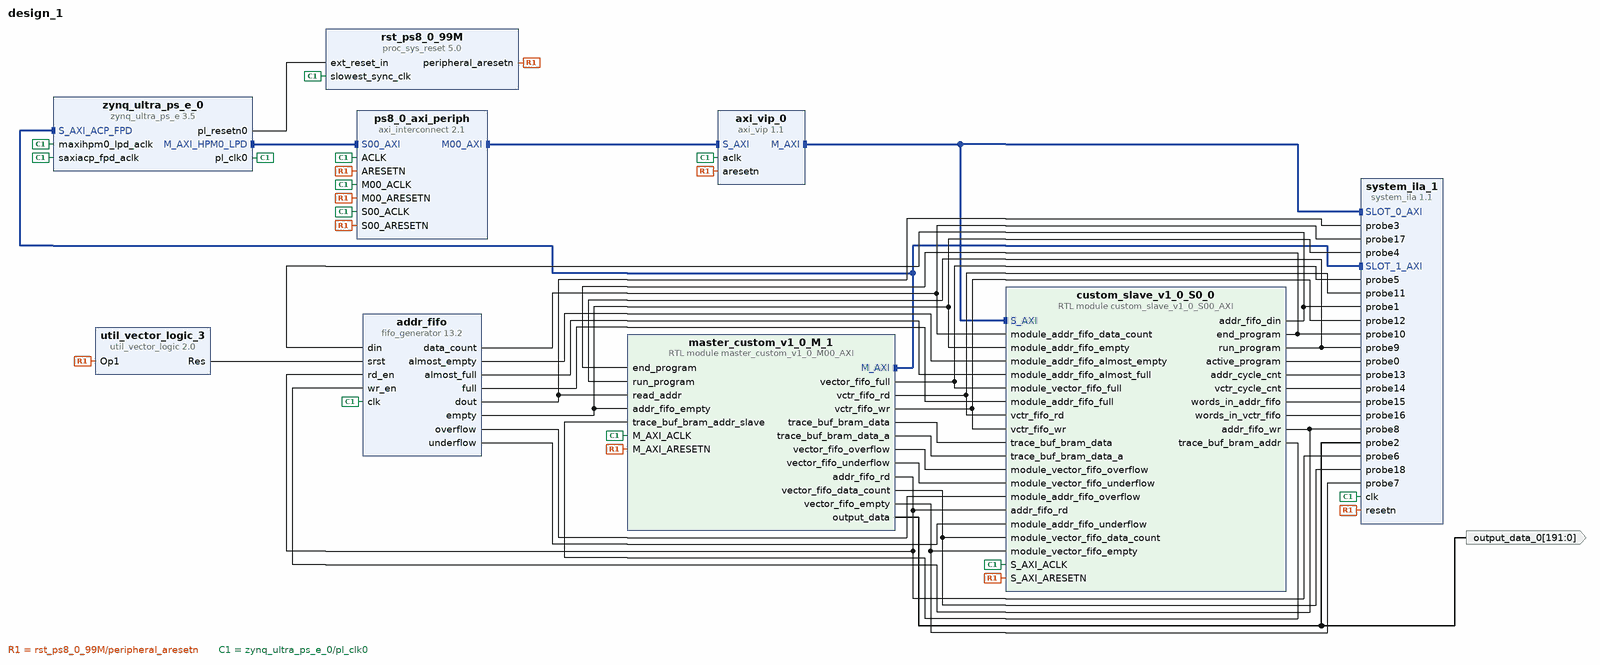
[diagram p0: block diagram of the top level]
# Vivado block design design_1, xczu9eg-ffvb1156-2-e, Vivado 2023.2
create_bd_design design_1

create_bd_port -dir O -from 191 -to 0 output_data_0

create_bd_cell -type ip -vlnv xilinx.com:ip:zynq_ultra_ps_e:3.5 zynq_ultra_ps_e_0
set_property -dict [list \
  CONFIG.CAN0_BOARD_INTERFACE custom \
  CONFIG.CAN1_BOARD_INTERFACE custom \
  CONFIG.CSU_BOARD_INTERFACE custom \
  CONFIG.DP_BOARD_INTERFACE custom \
  CONFIG.GEM0_BOARD_INTERFACE custom \
  CONFIG.GEM1_BOARD_INTERFACE custom \
  CONFIG.GEM2_BOARD_INTERFACE custom \
  CONFIG.GEM3_BOARD_INTERFACE custom \
  CONFIG.GPIO_BOARD_INTERFACE custom \
  CONFIG.IIC0_BOARD_INTERFACE custom \
  CONFIG.IIC1_BOARD_INTERFACE custom \
  CONFIG.NAND_BOARD_INTERFACE custom \
  CONFIG.PCIE_BOARD_INTERFACE custom \
  CONFIG.PJTAG_BOARD_INTERFACE custom \
  CONFIG.PMU_BOARD_INTERFACE custom \
  CONFIG.PSU_BANK_0_IO_STANDARD LVCMOS18 \
  CONFIG.PSU_BANK_1_IO_STANDARD LVCMOS18 \
  CONFIG.PSU_BANK_2_IO_STANDARD LVCMOS18 \
  CONFIG.PSU_BANK_3_IO_STANDARD LVCMOS18 \
  CONFIG.PSU_DYNAMIC_DDR_CONFIG_EN 1 \
  CONFIG.PSU_USB3__DUAL_CLOCK_ENABLE 1 \
  CONFIG.PSU__CAN1__PERIPHERAL__ENABLE 0 \
  CONFIG.PSU__CRF_APB__ACPU_CTRL__FREQMHZ 1200 \
  CONFIG.PSU__CRF_APB__ACPU_CTRL__SRCSEL APLL \
  CONFIG.PSU__CRF_APB__APLL_CTRL__SRCSEL PSS_REF_CLK \
  CONFIG.PSU__CRF_APB__DBG_FPD_CTRL__FREQMHZ 250 \
  CONFIG.PSU__CRF_APB__DBG_FPD_CTRL__SRCSEL IOPLL \
  CONFIG.PSU__CRF_APB__DBG_TRACE_CTRL__FREQMHZ 250 \
  CONFIG.PSU__CRF_APB__DBG_TRACE_CTRL__SRCSEL IOPLL \
  CONFIG.PSU__CRF_APB__DBG_TSTMP_CTRL__FREQMHZ 250 \
  CONFIG.PSU__CRF_APB__DBG_TSTMP_CTRL__SRCSEL IOPLL \
  CONFIG.PSU__CRF_APB__DDR_CTRL__FREQMHZ 800 \
  CONFIG.PSU__CRF_APB__DDR_CTRL__SRCSEL DPLL \
  CONFIG.PSU__CRF_APB__DPDMA_REF_CTRL__FREQMHZ 600 \
  CONFIG.PSU__CRF_APB__DPDMA_REF_CTRL__SRCSEL APLL \
  CONFIG.PSU__CRF_APB__DPLL_CTRL__SRCSEL PSS_REF_CLK \
  CONFIG.PSU__CRF_APB__DP_AUDIO_REF_CTRL__SRCSEL RPLL \
  CONFIG.PSU__CRF_APB__DP_STC_REF_CTRL__SRCSEL RPLL \
  CONFIG.PSU__CRF_APB__DP_VIDEO_REF_CTRL__SRCSEL VPLL \
  CONFIG.PSU__CRF_APB__GDMA_REF_CTRL__FREQMHZ 600 \
  CONFIG.PSU__CRF_APB__GDMA_REF_CTRL__SRCSEL APLL \
  CONFIG.PSU__CRF_APB__GPU_REF_CTRL__FREQMHZ 500 \
  CONFIG.PSU__CRF_APB__GPU_REF_CTRL__SRCSEL IOPLL \
  CONFIG.PSU__CRF_APB__TOPSW_LSBUS_CTRL__FREQMHZ 100 \
  CONFIG.PSU__CRF_APB__TOPSW_LSBUS_CTRL__SRCSEL IOPLL \
  CONFIG.PSU__CRF_APB__TOPSW_MAIN_CTRL__FREQMHZ 533.33 \
  CONFIG.PSU__CRF_APB__TOPSW_MAIN_CTRL__SRCSEL DPLL \
  CONFIG.PSU__CRF_APB__VPLL_CTRL__SRCSEL PSS_REF_CLK \
  CONFIG.PSU__CRL_APB__ADMA_REF_CTRL__FREQMHZ 500 \
  CONFIG.PSU__CRL_APB__ADMA_REF_CTRL__SRCSEL IOPLL \
  CONFIG.PSU__CRL_APB__CAN1_REF_CTRL__FREQMHZ 100 \
  CONFIG.PSU__CRL_APB__CAN1_REF_CTRL__SRCSEL IOPLL \
  CONFIG.PSU__CRL_APB__CPU_R5_CTRL__FREQMHZ 500 \
  CONFIG.PSU__CRL_APB__CPU_R5_CTRL__SRCSEL IOPLL \
  CONFIG.PSU__CRL_APB__DBG_LPD_CTRL__FREQMHZ 250 \
  CONFIG.PSU__CRL_APB__DBG_LPD_CTRL__SRCSEL IOPLL \
  CONFIG.PSU__CRL_APB__GEM3_REF_CTRL__FREQMHZ 125 \
  CONFIG.PSU__CRL_APB__GEM3_REF_CTRL__SRCSEL IOPLL \
  CONFIG.PSU__CRL_APB__I2C0_REF_CTRL__FREQMHZ 100 \
  CONFIG.PSU__CRL_APB__I2C0_REF_CTRL__SRCSEL IOPLL \
  CONFIG.PSU__CRL_APB__I2C1_REF_CTRL__FREQMHZ 100 \
  CONFIG.PSU__CRL_APB__I2C1_REF_CTRL__SRCSEL IOPLL \
  CONFIG.PSU__CRL_APB__IOPLL_CTRL__SRCSEL PSS_REF_CLK \
  CONFIG.PSU__CRL_APB__IOU_SWITCH_CTRL__FREQMHZ 250 \
  CONFIG.PSU__CRL_APB__IOU_SWITCH_CTRL__SRCSEL IOPLL \
  CONFIG.PSU__CRL_APB__LPD_LSBUS_CTRL__FREQMHZ 100 \
  CONFIG.PSU__CRL_APB__LPD_LSBUS_CTRL__SRCSEL IOPLL \
  CONFIG.PSU__CRL_APB__LPD_SWITCH_CTRL__FREQMHZ 500 \
  CONFIG.PSU__CRL_APB__LPD_SWITCH_CTRL__SRCSEL IOPLL \
  CONFIG.PSU__CRL_APB__PCAP_CTRL__FREQMHZ 200 \
  CONFIG.PSU__CRL_APB__PCAP_CTRL__SRCSEL IOPLL \
  CONFIG.PSU__CRL_APB__PL0_REF_CTRL__FREQMHZ 310 \
  CONFIG.PSU__CRL_APB__PL0_REF_CTRL__SRCSEL RPLL \
  CONFIG.PSU__CRL_APB__QSPI_REF_CTRL__FREQMHZ 125 \
  CONFIG.PSU__CRL_APB__QSPI_REF_CTRL__SRCSEL IOPLL \
  CONFIG.PSU__CRL_APB__RPLL_CTRL__SRCSEL PSS_REF_CLK \
  CONFIG.PSU__CRL_APB__SDIO1_REF_CTRL__FREQMHZ 200 \
  CONFIG.PSU__CRL_APB__SDIO1_REF_CTRL__SRCSEL IOPLL \
  CONFIG.PSU__CRL_APB__TIMESTAMP_REF_CTRL__FREQMHZ 100 \
  CONFIG.PSU__CRL_APB__TIMESTAMP_REF_CTRL__SRCSEL IOPLL \
  CONFIG.PSU__CRL_APB__UART0_REF_CTRL__FREQMHZ 100 \
  CONFIG.PSU__CRL_APB__UART0_REF_CTRL__SRCSEL IOPLL \
  CONFIG.PSU__CRL_APB__UART1_REF_CTRL__FREQMHZ 100 \
  CONFIG.PSU__CRL_APB__UART1_REF_CTRL__SRCSEL IOPLL \
  CONFIG.PSU__CRL_APB__USB0_BUS_REF_CTRL__FREQMHZ 250 \
  CONFIG.PSU__CRL_APB__USB0_BUS_REF_CTRL__SRCSEL IOPLL \
  CONFIG.PSU__CRL_APB__USB3_DUAL_REF_CTRL__FREQMHZ 20 \
  CONFIG.PSU__CRL_APB__USB3_DUAL_REF_CTRL__SRCSEL IOPLL \
  CONFIG.PSU__CRL_APB__USB3__ENABLE 1 \
  CONFIG.PSU__CSUPMU__PERIPHERAL__VALID 1 \
  CONFIG.PSU__DDRC__BUS_WIDTH {64 Bit} \
  CONFIG.PSU__DDRC__COMPONENTS UDIMM \
  CONFIG.PSU__DDRC__DEVICE_CAPACITY {4096 MBits} \
  CONFIG.PSU__DDRC__DRAM_WIDTH {8 Bits} \
  CONFIG.PSU__DDRC__ECC Enabled \
  CONFIG.PSU__DDRC__MEMORY_TYPE {DDR 4} \
  CONFIG.PSU__DDRC__SPEED_BIN DDR4_1600J \
  CONFIG.PSU__DDR_HIGH_ADDRESS_GUI_ENABLE 1 \
  CONFIG.PSU__DDR__INTERFACE__FREQMHZ 400.000 \
  CONFIG.PSU__DEVICE_TYPE EG \
  CONFIG.PSU__DISPLAYPORT__PERIPHERAL__ENABLE 0 \
  CONFIG.PSU__DLL__ISUSED 1 \
  CONFIG.PSU__ENET3__FIFO__ENABLE 0 \
  CONFIG.PSU__ENET3__GRP_MDIO__ENABLE 1 \
  CONFIG.PSU__ENET3__GRP_MDIO__IO {MIO 76 .. 77} \
  CONFIG.PSU__ENET3__PERIPHERAL__ENABLE 1 \
  CONFIG.PSU__ENET3__PERIPHERAL__IO {MIO 64 .. 75} \
  CONFIG.PSU__ENET3__PTP__ENABLE 0 \
  CONFIG.PSU__ENET3__TSU__ENABLE 0 \
  CONFIG.PSU__FPGA_PL0_ENABLE 1 \
  CONFIG.PSU__GEM3_COHERENCY 0 \
  CONFIG.PSU__GEM3_ROUTE_THROUGH_FPD 0 \
  CONFIG.PSU__GEM__TSU__ENABLE 0 \
  CONFIG.PSU__GPIO0_MIO__IO {MIO 0 .. 25} \
  CONFIG.PSU__GPIO0_MIO__PERIPHERAL__ENABLE 1 \
  CONFIG.PSU__GPIO1_MIO__IO {MIO 26 .. 51} \
  CONFIG.PSU__GPIO1_MIO__PERIPHERAL__ENABLE 1 \
  CONFIG.PSU__I2C0__PERIPHERAL__ENABLE 1 \
  CONFIG.PSU__I2C0__PERIPHERAL__IO {MIO 14 .. 15} \
  CONFIG.PSU__I2C1__PERIPHERAL__ENABLE 1 \
  CONFIG.PSU__I2C1__PERIPHERAL__IO {MIO 16 .. 17} \
  CONFIG.PSU__IOU_SLCR__IOU_TTC_APB_CLK__TTC0_SEL APB \
  CONFIG.PSU__IOU_SLCR__IOU_TTC_APB_CLK__TTC1_SEL APB \
  CONFIG.PSU__IOU_SLCR__IOU_TTC_APB_CLK__TTC2_SEL APB \
  CONFIG.PSU__IOU_SLCR__IOU_TTC_APB_CLK__TTC3_SEL APB \
  CONFIG.PSU__OVERRIDE_HPX_QOS 0 \
  CONFIG.PSU__OVERRIDE__BASIC_CLOCK 0 \
  CONFIG.PSU__PCIE__CLASS_CODE_BASE 0x06 \
  CONFIG.PSU__PCIE__CLASS_CODE_INTERFACE 0x0 \
  CONFIG.PSU__PCIE__CLASS_CODE_SUB 0x4 \
  CONFIG.PSU__PCIE__DEVICE_ID 0xD021 \
  CONFIG.PSU__PCIE__REVISION_ID 0x0 \
  CONFIG.PSU__PCIE__SUBSYSTEM_ID 0x7 \
  CONFIG.PSU__PCIE__SUBSYSTEM_VENDOR_ID 0x10EE \
  CONFIG.PSU__PCIE__VENDOR_ID 0x10EE \
  CONFIG.PSU__PMU_COHERENCY 0 \
  CONFIG.PSU__PMU__AIBACK__ENABLE 0 \
  CONFIG.PSU__PMU__EMIO_GPI__ENABLE 0 \
  CONFIG.PSU__PMU__EMIO_GPO__ENABLE 0 \
  CONFIG.PSU__PMU__GPI0__ENABLE 0 \
  CONFIG.PSU__PMU__GPI1__ENABLE 0 \
  CONFIG.PSU__PMU__GPI2__ENABLE 0 \
  CONFIG.PSU__PMU__GPI3__ENABLE 0 \
  CONFIG.PSU__PMU__GPI4__ENABLE 0 \
  CONFIG.PSU__PMU__GPI5__ENABLE 0 \
  CONFIG.PSU__PMU__GPO0__ENABLE 0 \
  CONFIG.PSU__PMU__GPO1__ENABLE 0 \
  CONFIG.PSU__PMU__GPO2__ENABLE 1 \
  CONFIG.PSU__PMU__GPO2__IO {MIO 34} \
  CONFIG.PSU__PMU__GPO2__POLARITY high \
  CONFIG.PSU__PMU__GPO3__ENABLE 0 \
  CONFIG.PSU__PMU__GPO4__ENABLE 0 \
  CONFIG.PSU__PMU__GPO5__ENABLE 0 \
  CONFIG.PSU__PMU__PERIPHERAL__ENABLE 1 \
  CONFIG.PSU__PMU__PLERROR__ENABLE 0 \
  CONFIG.PSU__PRESET_APPLIED 1 \
  CONFIG.PSU__PSS_REF_CLK__FREQMHZ 33.330 \
  CONFIG.PSU__QSPI_COHERENCY 0 \
  CONFIG.PSU__QSPI_ROUTE_THROUGH_FPD 0 \
  CONFIG.PSU__QSPI__GRP_FBCLK__ENABLE 1 \
  CONFIG.PSU__QSPI__GRP_FBCLK__IO {MIO 6} \
  CONFIG.PSU__QSPI__PERIPHERAL__DATA_MODE x4 \
  CONFIG.PSU__QSPI__PERIPHERAL__ENABLE 1 \
  CONFIG.PSU__QSPI__PERIPHERAL__IO {MIO 0 .. 12} \
  CONFIG.PSU__QSPI__PERIPHERAL__MODE {Dual Parallel} \
  CONFIG.PSU__SATA__PERIPHERAL__ENABLE 0 \
  CONFIG.PSU__SD0__CLK_100_SDR_OTAP_DLY 0x3 \
  CONFIG.PSU__SD0__CLK_200_SDR_OTAP_DLY 0x3 \
  CONFIG.PSU__SD0__CLK_50_DDR_ITAP_DLY 0x3D \
  CONFIG.PSU__SD0__CLK_50_DDR_OTAP_DLY 0x4 \
  CONFIG.PSU__SD0__CLK_50_SDR_ITAP_DLY 0x15 \
  CONFIG.PSU__SD0__CLK_50_SDR_OTAP_DLY 0x5 \
  CONFIG.PSU__SD1_COHERENCY 0 \
  CONFIG.PSU__SD1_ROUTE_THROUGH_FPD 0 \
  CONFIG.PSU__SD1__CLK_100_SDR_OTAP_DLY 0x3 \
  CONFIG.PSU__SD1__CLK_200_SDR_OTAP_DLY 0x3 \
  CONFIG.PSU__SD1__CLK_50_DDR_ITAP_DLY 0x3D \
  CONFIG.PSU__SD1__CLK_50_DDR_OTAP_DLY 0x4 \
  CONFIG.PSU__SD1__CLK_50_SDR_ITAP_DLY 0x15 \
  CONFIG.PSU__SD1__CLK_50_SDR_OTAP_DLY 0x5 \
  CONFIG.PSU__SD1__DATA_TRANSFER_MODE 8Bit \
  CONFIG.PSU__SD1__GRP_CD__ENABLE 1 \
  CONFIG.PSU__SD1__GRP_CD__IO {MIO 45} \
  CONFIG.PSU__SD1__GRP_POW__ENABLE 0 \
  CONFIG.PSU__SD1__GRP_WP__ENABLE 1 \
  CONFIG.PSU__SD1__GRP_WP__IO {MIO 44} \
  CONFIG.PSU__SD1__PERIPHERAL__ENABLE 1 \
  CONFIG.PSU__SD1__PERIPHERAL__IO {MIO 39 .. 51} \
  CONFIG.PSU__SD1__SLOT_TYPE {SD 3.0} \
  CONFIG.PSU__SWDT0__CLOCK__ENABLE 0 \
  CONFIG.PSU__SWDT0__PERIPHERAL__ENABLE 1 \
  CONFIG.PSU__SWDT0__RESET__ENABLE 0 \
  CONFIG.PSU__SWDT1__CLOCK__ENABLE 0 \
  CONFIG.PSU__SWDT1__PERIPHERAL__ENABLE 1 \
  CONFIG.PSU__SWDT1__RESET__ENABLE 0 \
  CONFIG.PSU__TSU__BUFG_PORT_PAIR 0 \
  CONFIG.PSU__TTC0__CLOCK__ENABLE 0 \
  CONFIG.PSU__TTC0__PERIPHERAL__ENABLE 1 \
  CONFIG.PSU__TTC0__WAVEOUT__ENABLE 0 \
  CONFIG.PSU__TTC1__CLOCK__ENABLE 0 \
  CONFIG.PSU__TTC1__PERIPHERAL__ENABLE 1 \
  CONFIG.PSU__TTC1__WAVEOUT__ENABLE 0 \
  CONFIG.PSU__TTC2__CLOCK__ENABLE 0 \
  CONFIG.PSU__TTC2__PERIPHERAL__ENABLE 1 \
  CONFIG.PSU__TTC2__WAVEOUT__ENABLE 0 \
  CONFIG.PSU__TTC3__CLOCK__ENABLE 0 \
  CONFIG.PSU__TTC3__PERIPHERAL__ENABLE 1 \
  CONFIG.PSU__TTC3__WAVEOUT__ENABLE 0 \
  CONFIG.PSU__UART0__BAUD_RATE 115200 \
  CONFIG.PSU__UART0__MODEM__ENABLE 0 \
  CONFIG.PSU__UART0__PERIPHERAL__ENABLE 1 \
  CONFIG.PSU__UART0__PERIPHERAL__IO {MIO 18 .. 19} \
  CONFIG.PSU__UART1__BAUD_RATE 115200 \
  CONFIG.PSU__UART1__MODEM__ENABLE 0 \
  CONFIG.PSU__UART1__PERIPHERAL__ENABLE 1 \
  CONFIG.PSU__UART1__PERIPHERAL__IO {MIO 20 .. 21} \
  CONFIG.PSU__USB0_COHERENCY 0 \
  CONFIG.PSU__USB0__PERIPHERAL__ENABLE 1 \
  CONFIG.PSU__USB0__PERIPHERAL__IO {MIO 52 .. 63} \
  CONFIG.PSU__USB0__REF_CLK_FREQ 26 \
  CONFIG.PSU__USB0__REF_CLK_SEL {Ref Clk2} \
  CONFIG.PSU__USB2_0__EMIO__ENABLE 0 \
  CONFIG.PSU__USB3_0__EMIO__ENABLE 0 \
  CONFIG.PSU__USB3_0__PERIPHERAL__ENABLE 1 \
  CONFIG.PSU__USB3_0__PERIPHERAL__IO {GT Lane2} \
  CONFIG.PSU__USB__RESET__MODE {Boot Pin} \
  CONFIG.PSU__USB__RESET__POLARITY {Active Low} \
  CONFIG.PSU__USE__IRQ0 1 \
  CONFIG.PSU__USE__M_AXI_GP0 0 \
  CONFIG.PSU__USE__M_AXI_GP1 0 \
  CONFIG.PSU__USE__M_AXI_GP2 1 \
  CONFIG.PSU__USE__S_AXI_ACP 1 \
  CONFIG.QSPI_BOARD_INTERFACE custom \
  CONFIG.SATA_BOARD_INTERFACE custom \
  CONFIG.SD0_BOARD_INTERFACE custom \
  CONFIG.SD1_BOARD_INTERFACE custom \
  CONFIG.SPI0_BOARD_INTERFACE custom \
  CONFIG.SPI1_BOARD_INTERFACE custom \
  CONFIG.SUBPRESET1 Custom \
  CONFIG.SUBPRESET2 Custom \
  CONFIG.SWDT0_BOARD_INTERFACE custom \
  CONFIG.SWDT1_BOARD_INTERFACE custom \
  CONFIG.TRACE_BOARD_INTERFACE custom \
  CONFIG.TTC0_BOARD_INTERFACE custom \
  CONFIG.TTC1_BOARD_INTERFACE custom \
  CONFIG.TTC2_BOARD_INTERFACE custom \
  CONFIG.TTC3_BOARD_INTERFACE custom \
  CONFIG.UART0_BOARD_INTERFACE custom \
  CONFIG.UART1_BOARD_INTERFACE custom \
  CONFIG.USB0_BOARD_INTERFACE custom \
  CONFIG.USB1_BOARD_INTERFACE custom \
  CONFIG.preset None \
] [get_bd_cells zynq_ultra_ps_e_0]
# 741 more settings of zynq_ultra_ps_e_0 are not shown: defaults, MIO pin electricals, DDR timing, and values the tool derives
create_bd_cell -type ip -vlnv xilinx.com:ip:proc_sys_reset:5.0 rst_ps8_0_99M
create_bd_cell -type ip -vlnv xilinx.com:ip:axi_interconnect:2.1 ps8_0_axi_periph
set_property -dict {CONFIG.NUM_MI 1} [get_bd_cells ps8_0_axi_periph]
create_bd_cell -type ip -vlnv xilinx.com:ip:fifo_generator:13.2 addr_fifo
set_property -dict [list \
  CONFIG.Almost_Empty_Flag true \
  CONFIG.Almost_Full_Flag true \
  CONFIG.Data_Count true \
  CONFIG.Fifo_Implementation Common_Clock_Block_RAM \
  CONFIG.INTERFACE_TYPE Native \
  CONFIG.Input_Data_Width 32 \
  CONFIG.Input_Depth 8192 \
  CONFIG.Overflow_Flag true \
  CONFIG.Performance_Options First_Word_Fall_Through \
  CONFIG.READ_WRITE_MODE WRITE_ONLY \
  CONFIG.Underflow_Flag true \
  CONFIG.Use_Embedded_Registers false \
  CONFIG.Valid_Flag true \
  CONFIG.Write_Acknowledge_Flag true \
] [get_bd_cells addr_fifo]
create_bd_cell -type ip -vlnv xilinx.com:ip:util_vector_logic:2.0 util_vector_logic_3
set_property -dict {CONFIG.C_OPERATION not CONFIG.C_SIZE 1} [get_bd_cells util_vector_logic_3]
create_bd_cell -type ip -vlnv xilinx.com:ip:system_ila:1.1 system_ila_1
set_property -dict [list \
  CONFIG.C_DATA_DEPTH 8192 \
  CONFIG.C_MON_TYPE MIX \
  CONFIG.C_NUM_MONITOR_SLOTS 2 \
  CONFIG.C_NUM_OF_PROBES 19 \
  CONFIG.C_PROBE0_TYPE 0 \
  CONFIG.C_PROBE1_TYPE 0 \
  CONFIG.C_PROBE2_TYPE 0 \
  CONFIG.C_PROBE3_TYPE 0 \
  CONFIG.C_PROBE4_TYPE 0 \
  CONFIG.C_PROBE5_TYPE 0 \
  CONFIG.C_PROBE6_TYPE 0 \
  CONFIG.C_PROBE7_TYPE 0 \
  CONFIG.C_PROBE8_TYPE 0 \
  CONFIG.C_SLOT_0_APC_EN 0 \
  CONFIG.C_SLOT_0_AXI_AR_SEL_DATA 1 \
  CONFIG.C_SLOT_0_AXI_AR_SEL_TRIG 1 \
  CONFIG.C_SLOT_0_AXI_AW_SEL_DATA 1 \
  CONFIG.C_SLOT_0_AXI_AW_SEL_TRIG 1 \
  CONFIG.C_SLOT_0_AXI_B_SEL_DATA 1 \
  CONFIG.C_SLOT_0_AXI_B_SEL_TRIG 1 \
  CONFIG.C_SLOT_0_AXI_R_SEL_DATA 1 \
  CONFIG.C_SLOT_0_AXI_R_SEL_TRIG 1 \
  CONFIG.C_SLOT_0_AXI_W_SEL_DATA 1 \
  CONFIG.C_SLOT_0_AXI_W_SEL_TRIG 1 \
  CONFIG.C_SLOT_0_INTF_TYPE xilinx.com:interface:aximm_rtl:1.0 \
  CONFIG.C_SLOT_1_APC_EN 0 \
  CONFIG.C_SLOT_1_AXI_AR_SEL_DATA 1 \
  CONFIG.C_SLOT_1_AXI_AR_SEL_TRIG 1 \
  CONFIG.C_SLOT_1_AXI_AW_SEL_DATA 1 \
  CONFIG.C_SLOT_1_AXI_AW_SEL_TRIG 1 \
  CONFIG.C_SLOT_1_AXI_B_SEL_DATA 1 \
  CONFIG.C_SLOT_1_AXI_B_SEL_TRIG 1 \
  CONFIG.C_SLOT_1_AXI_R_SEL_DATA 1 \
  CONFIG.C_SLOT_1_AXI_R_SEL_TRIG 1 \
  CONFIG.C_SLOT_1_AXI_W_SEL_DATA 1 \
  CONFIG.C_SLOT_1_AXI_W_SEL_TRIG 1 \
  CONFIG.C_SLOT_1_INTF_TYPE xilinx.com:interface:aximm_rtl:1.0 \
] [get_bd_cells system_ila_1]
create_bd_cell -type module -reference custom_slave_v1_0_S00_AXI custom_slave_v1_0_S0_0
set_property -dict [list \
  CONFIG.C_S_AXI_ARUSER_WIDTH 0 \
  CONFIG.C_S_AXI_AWUSER_WIDTH 0 \
  CONFIG.C_S_AXI_ID_WIDTH 16 \
  CONFIG.C_S_AXI_RUSER_WIDTH 16 \
  CONFIG.C_S_AXI_WUSER_WIDTH 16 \
] [get_bd_cells custom_slave_v1_0_S0_0]
create_bd_cell -type ip -vlnv xilinx.com:ip:axi_vip:1.1 axi_vip_0
set_property -dict {CONFIG.INTERFACE_MODE PASS_THROUGH} [get_bd_cells axi_vip_0]
create_bd_cell -type module -reference master_custom_v1_0_M00_AXI master_custom_v1_0_M_1
set_property -dict [list \
  CONFIG.C_M_AXI_BURST_LEN 1 \
  CONFIG.C_M_AXI_DATA_WIDTH 128 \
  CONFIG.TRACE_BUF_DATA_WIDTH 256 \
  CONFIG.VECTOR_FIFO_DEPTH 2048 \
  CONFIG.axi_prot 2 \
  CONFIG.cache_value 15 \
] [get_bd_cells master_custom_v1_0_M_1]

# ---- connections ----

connect_bd_intf_net -intf_net driver_ctrl_M00_AXI [get_bd_intf_pins zynq_ultra_ps_e_0/S_AXI_ACP_FPD] [get_bd_intf_pins master_custom_v1_0_M_1/M_AXI]
connect_bd_intf_net [get_bd_intf_pins zynq_ultra_ps_e_0/S_AXI_ACP_FPD] [get_bd_intf_pins system_ila_1/SLOT_1_AXI]
connect_bd_intf_net -intf_net ps8_0_axi_periph_M00_AXI [get_bd_intf_pins axi_vip_0/M_AXI] [get_bd_intf_pins custom_slave_v1_0_S0_0/S_AXI]
connect_bd_intf_net [get_bd_intf_pins axi_vip_0/M_AXI] [get_bd_intf_pins system_ila_1/SLOT_0_AXI]
connect_bd_intf_net [get_bd_intf_pins ps8_0_axi_periph/M00_AXI] [get_bd_intf_pins axi_vip_0/S_AXI]
connect_bd_intf_net [get_bd_intf_pins ps8_0_axi_periph/S00_AXI] [get_bd_intf_pins zynq_ultra_ps_e_0/M_AXI_HPM0_LPD]
connect_bd_net [get_bd_pins addr_fifo/almost_empty] [get_bd_pins custom_slave_v1_0_S0_0/module_addr_fifo_almost_empty]
connect_bd_net [get_bd_pins addr_fifo/almost_full] [get_bd_pins custom_slave_v1_0_S0_0/module_addr_fifo_almost_full]
connect_bd_net -net addr_fifo_data_count [get_bd_pins addr_fifo/data_count] \
  [get_bd_pins system_ila_1/probe17] [get_bd_pins custom_slave_v1_0_S0_0/module_addr_fifo_data_count]
connect_bd_net [get_bd_pins addr_fifo/full] [get_bd_pins custom_slave_v1_0_S0_0/module_addr_fifo_full]
connect_bd_net [get_bd_pins addr_fifo/overflow] [get_bd_pins custom_slave_v1_0_S0_0/module_addr_fifo_overflow]
connect_bd_net [get_bd_pins addr_fifo/underflow] [get_bd_pins custom_slave_v1_0_S0_0/module_addr_fifo_underflow]
connect_bd_net -net custom_slave_0_start_read_tx [get_bd_pins custom_slave_v1_0_S0_0/active_program] [get_bd_pins system_ila_1/probe0]
connect_bd_net -net custom_slave_0_target_base_addr [get_bd_pins custom_slave_v1_0_S0_0/addr_fifo_din] \
  [get_bd_pins addr_fifo/din] [get_bd_pins system_ila_1/probe1]
connect_bd_net -net custom_slave_v1_0_S0_0_addr_cycle_cnt [get_bd_pins custom_slave_v1_0_S0_0/addr_cycle_cnt] [get_bd_pins system_ila_1/probe13]
connect_bd_net -net custom_slave_v1_0_S0_0_end_program [get_bd_pins custom_slave_v1_0_S0_0/end_program] \
  [get_bd_pins system_ila_1/probe10] [get_bd_pins master_custom_v1_0_M_1/end_program]
connect_bd_net -net custom_slave_v1_0_S0_0_run_program [get_bd_pins custom_slave_v1_0_S0_0/run_program] \
  [get_bd_pins system_ila_1/probe9] [get_bd_pins master_custom_v1_0_M_1/run_program]
connect_bd_net [get_bd_pins custom_slave_v1_0_S0_0/trace_buf_bram_addr] [get_bd_pins master_custom_v1_0_M_1/trace_buf_bram_addr_slave]
connect_bd_net -net custom_slave_v1_0_S0_0_vctr_cycle_cnt [get_bd_pins custom_slave_v1_0_S0_0/vctr_cycle_cnt] [get_bd_pins system_ila_1/probe14]
connect_bd_net -net custom_slave_v1_0_S0_0_words_in_addr_fifo [get_bd_pins custom_slave_v1_0_S0_0/words_in_addr_fifo] \
  [get_bd_pins system_ila_1/probe15]
connect_bd_net -net custom_slave_v1_0_S0_0_words_in_vctr_fifo [get_bd_pins custom_slave_v1_0_S0_0/words_in_vctr_fifo] \
  [get_bd_pins system_ila_1/probe16]
connect_bd_net -net fifo_generator_0_dout_1 [get_bd_pins addr_fifo/dout] \
  [get_bd_pins system_ila_1/probe3] [get_bd_pins master_custom_v1_0_M_1/read_addr]
connect_bd_net -net fifo_generator_0_empty [get_bd_pins addr_fifo/empty] \
  [get_bd_pins system_ila_1/probe4] [get_bd_pins master_custom_v1_0_M_1/addr_fifo_empty] \
  [get_bd_pins custom_slave_v1_0_S0_0/module_addr_fifo_empty]
connect_bd_net -net full [get_bd_pins master_custom_v1_0_M_1/vector_fifo_full] \
  [get_bd_pins system_ila_1/probe5] [get_bd_pins custom_slave_v1_0_S0_0/module_vector_fifo_full]
connect_bd_net -net master_custom_v1_0_M_1_addr_fifo_rd [get_bd_pins master_custom_v1_0_M_1/addr_fifo_rd] \
  [get_bd_pins addr_fifo/rd_en] [get_bd_pins system_ila_1/probe6] [get_bd_pins custom_slave_v1_0_S0_0/addr_fifo_rd]
connect_bd_net [get_bd_pins master_custom_v1_0_M_1/output_data] [get_bd_ports output_data_0] [get_bd_pins system_ila_1/probe2]
connect_bd_net [get_bd_pins master_custom_v1_0_M_1/trace_buf_bram_data] [get_bd_pins custom_slave_v1_0_S0_0/trace_buf_bram_data]
connect_bd_net [get_bd_pins master_custom_v1_0_M_1/trace_buf_bram_data_a] [get_bd_pins custom_slave_v1_0_S0_0/trace_buf_bram_data_a]
connect_bd_net -net master_custom_v1_0_M_1_vctr_fifo_rd [get_bd_pins master_custom_v1_0_M_1/vctr_fifo_rd] \
  [get_bd_pins system_ila_1/probe11] [get_bd_pins custom_slave_v1_0_S0_0/vctr_fifo_rd]
connect_bd_net -net master_custom_v1_0_M_1_vctr_fifo_wr [get_bd_pins master_custom_v1_0_M_1/vctr_fifo_wr] \
  [get_bd_pins system_ila_1/probe12] [get_bd_pins custom_slave_v1_0_S0_0/vctr_fifo_wr]
connect_bd_net -net master_custom_v1_0_M_1_vector_fifo_data_count [get_bd_pins master_custom_v1_0_M_1/vector_fifo_data_count] \
  [get_bd_pins system_ila_1/probe18] [get_bd_pins custom_slave_v1_0_S0_0/module_vector_fifo_data_count]
connect_bd_net -net master_custom_v1_0_M_1_vector_fifo_empty [get_bd_pins master_custom_v1_0_M_1/vector_fifo_empty] \
  [get_bd_pins system_ila_1/probe7] [get_bd_pins custom_slave_v1_0_S0_0/module_vector_fifo_empty]
connect_bd_net [get_bd_pins master_custom_v1_0_M_1/vector_fifo_overflow] [get_bd_pins custom_slave_v1_0_S0_0/module_vector_fifo_overflow]
connect_bd_net [get_bd_pins master_custom_v1_0_M_1/vector_fifo_underflow] [get_bd_pins custom_slave_v1_0_S0_0/module_vector_fifo_underflow]
connect_bd_net [get_bd_pins rst_ps8_0_99M/peripheral_aresetn] \
  [get_bd_pins ps8_0_axi_periph/S00_ARESETN] [get_bd_pins ps8_0_axi_periph/M00_ARESETN] \
  [get_bd_pins ps8_0_axi_periph/ARESETN] [get_bd_pins util_vector_logic_3/Op1] [get_bd_pins system_ila_1/resetn] \
  [get_bd_pins axi_vip_0/aresetn] [get_bd_pins master_custom_v1_0_M_1/M_AXI_ARESETN] \
  [get_bd_pins custom_slave_v1_0_S0_0/S_AXI_ARESETN]
connect_bd_net -net testbench_pattern_gen_0_wr_en [get_bd_pins custom_slave_v1_0_S0_0/addr_fifo_wr] \
  [get_bd_pins addr_fifo/wr_en] [get_bd_pins system_ila_1/probe8]
connect_bd_net -net util_vector_logic_0_Res_1 [get_bd_pins util_vector_logic_3/Res] [get_bd_pins addr_fifo/srst]
connect_bd_net [get_bd_pins zynq_ultra_ps_e_0/pl_clk0] \
  [get_bd_pins ps8_0_axi_periph/ACLK] [get_bd_pins ps8_0_axi_periph/M00_ACLK] [get_bd_pins ps8_0_axi_periph/S00_ACLK] \
  [get_bd_pins rst_ps8_0_99M/slowest_sync_clk] [get_bd_pins addr_fifo/clk] [get_bd_pins system_ila_1/clk] \
  [get_bd_pins axi_vip_0/aclk] [get_bd_pins master_custom_v1_0_M_1/M_AXI_ACLK] \
  [get_bd_pins custom_slave_v1_0_S0_0/S_AXI_ACLK] [get_bd_pins zynq_ultra_ps_e_0/maxihpm0_lpd_aclk] \
  [get_bd_pins zynq_ultra_ps_e_0/saxiacp_fpd_aclk]
connect_bd_net [get_bd_pins zynq_ultra_ps_e_0/pl_resetn0] [get_bd_pins rst_ps8_0_99M/ext_reset_in]
set_property HDL_ATTRIBUTE.DEBUG true [get_bd_intf_nets driver_ctrl_M00_AXI]
set_property HDL_ATTRIBUTE.MARK_DEBUG true [get_bd_intf_nets driver_ctrl_M00_AXI]
set_property HDL_ATTRIBUTE.DEBUG true [get_bd_intf_nets ps8_0_axi_periph_M00_AXI]
set_property HDL_ATTRIBUTE.MARK_DEBUG true [get_bd_intf_nets ps8_0_axi_periph_M00_AXI]
set_property HDL_ATTRIBUTE.DEBUG true [get_bd_nets addr_fifo_data_count]
set_property HDL_ATTRIBUTE.MARK_DEBUG true [get_bd_nets addr_fifo_data_count]
set_property HDL_ATTRIBUTE.DEBUG true [get_bd_nets custom_slave_0_start_read_tx]
set_property HDL_ATTRIBUTE.MARK_DEBUG true [get_bd_nets custom_slave_0_start_read_tx]
set_property HDL_ATTRIBUTE.DEBUG true [get_bd_nets custom_slave_0_target_base_addr]
set_property HDL_ATTRIBUTE.MARK_DEBUG true [get_bd_nets custom_slave_0_target_base_addr]
set_property HDL_ATTRIBUTE.DEBUG true [get_bd_nets custom_slave_v1_0_S0_0_addr_cycle_cnt]
set_property HDL_ATTRIBUTE.MARK_DEBUG true [get_bd_nets custom_slave_v1_0_S0_0_addr_cycle_cnt]
set_property HDL_ATTRIBUTE.DEBUG true [get_bd_nets custom_slave_v1_0_S0_0_end_program]
set_property HDL_ATTRIBUTE.MARK_DEBUG true [get_bd_nets custom_slave_v1_0_S0_0_end_program]
set_property HDL_ATTRIBUTE.DEBUG true [get_bd_nets custom_slave_v1_0_S0_0_run_program]
set_property HDL_ATTRIBUTE.MARK_DEBUG true [get_bd_nets custom_slave_v1_0_S0_0_run_program]
set_property HDL_ATTRIBUTE.DEBUG true [get_bd_nets custom_slave_v1_0_S0_0_vctr_cycle_cnt]
set_property HDL_ATTRIBUTE.MARK_DEBUG true [get_bd_nets custom_slave_v1_0_S0_0_vctr_cycle_cnt]
set_property HDL_ATTRIBUTE.DEBUG true [get_bd_nets custom_slave_v1_0_S0_0_words_in_addr_fifo]
set_property HDL_ATTRIBUTE.MARK_DEBUG true [get_bd_nets custom_slave_v1_0_S0_0_words_in_addr_fifo]
set_property HDL_ATTRIBUTE.DEBUG true [get_bd_nets custom_slave_v1_0_S0_0_words_in_vctr_fifo]
set_property HDL_ATTRIBUTE.MARK_DEBUG true [get_bd_nets custom_slave_v1_0_S0_0_words_in_vctr_fifo]
set_property HDL_ATTRIBUTE.DEBUG true [get_bd_nets fifo_generator_0_dout_1]
set_property HDL_ATTRIBUTE.MARK_DEBUG true [get_bd_nets fifo_generator_0_dout_1]
set_property HDL_ATTRIBUTE.DEBUG true [get_bd_nets fifo_generator_0_empty]
set_property HDL_ATTRIBUTE.MARK_DEBUG true [get_bd_nets fifo_generator_0_empty]
set_property HDL_ATTRIBUTE.DEBUG true [get_bd_nets full]
set_property HDL_ATTRIBUTE.MARK_DEBUG true [get_bd_nets full]
set_property HDL_ATTRIBUTE.DEBUG true [get_bd_nets master_custom_v1_0_M_1_addr_fifo_rd]
set_property HDL_ATTRIBUTE.MARK_DEBUG true [get_bd_nets master_custom_v1_0_M_1_addr_fifo_rd]
set_property HDL_ATTRIBUTE.DEBUG true [get_bd_nets master_custom_v1_0_M_1_vctr_fifo_rd]
set_property HDL_ATTRIBUTE.MARK_DEBUG true [get_bd_nets master_custom_v1_0_M_1_vctr_fifo_rd]
set_property HDL_ATTRIBUTE.DEBUG true [get_bd_nets master_custom_v1_0_M_1_vctr_fifo_wr]
set_property HDL_ATTRIBUTE.MARK_DEBUG true [get_bd_nets master_custom_v1_0_M_1_vctr_fifo_wr]
set_property HDL_ATTRIBUTE.DEBUG true [get_bd_nets master_custom_v1_0_M_1_vector_fifo_data_count]
set_property HDL_ATTRIBUTE.MARK_DEBUG true [get_bd_nets master_custom_v1_0_M_1_vector_fifo_data_count]
set_property HDL_ATTRIBUTE.DEBUG true [get_bd_nets master_custom_v1_0_M_1_vector_fifo_empty]
set_property HDL_ATTRIBUTE.MARK_DEBUG true [get_bd_nets master_custom_v1_0_M_1_vector_fifo_empty]
set_property HDL_ATTRIBUTE.DEBUG true [get_bd_nets testbench_pattern_gen_0_wr_en]
set_property HDL_ATTRIBUTE.MARK_DEBUG true [get_bd_nets testbench_pattern_gen_0_wr_en]

# ---- address map ----
assign_bd_address -offset 0x00000000 -range 2G -target_address_space [get_bd_addr_spaces master_custom_v1_0_M_1/M_AXI] [get_bd_addr_segs zynq_ultra_ps_e_0/SAXIACP/ACP_DDR_LOW]
assign_bd_address -offset 0xC0000000 -range 512M -target_address_space [get_bd_addr_spaces master_custom_v1_0_M_1/M_AXI] [get_bd_addr_segs zynq_ultra_ps_e_0/SAXIACP/ACP_QSPI]
assign_bd_address -offset 0xFF000000 -range 16M -target_address_space [get_bd_addr_spaces master_custom_v1_0_M_1/M_AXI] [get_bd_addr_segs zynq_ultra_ps_e_0/SAXIACP/ACP_LPS_OCM]
exclude_bd_addr_seg -offset 0x00000000 -range 1 -target_address_space [get_bd_addr_spaces master_custom_v1_0_M_1/M_AXI] [get_bd_addr_segs zynq_ultra_ps_e_0/SAXIACP/ACP_DDR_HIGH]
assign_bd_address -offset 0x0080000000 -range 4K -target_address_space [get_bd_addr_spaces zynq_ultra_ps_e_0/Data] [get_bd_addr_segs custom_slave_v1_0_S0_0/S_AXI/reg0]

validate_bd_design
save_bd_design
